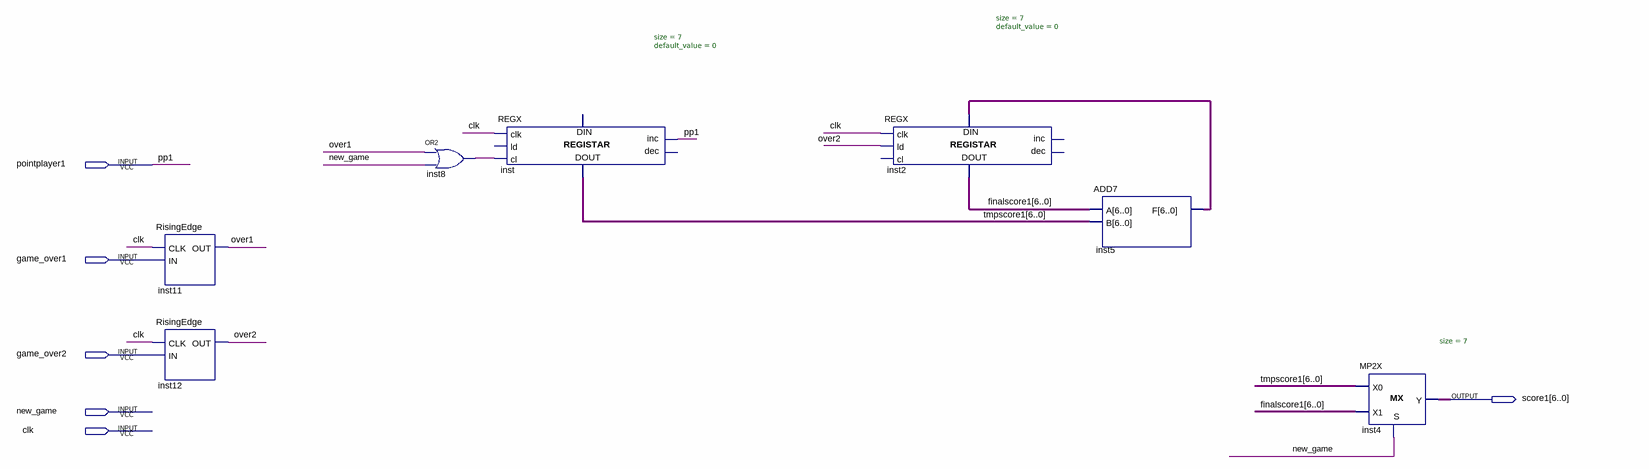
[diagram p0: schematic sheet]
// Quartus schematic score_count.bdf as structural Verilog: 7 symbols, 6 pins
module score_count (
  input  pointplayer1,
  input  game_over1,
  input  game_over2,
  input  new_game,
  input  clk,
  output [6:0] score1
);

  wire inst8_out, over1, over2;
  wire [6:0] finalscore1, inst5_f, tmpscore1;

  RisingEdge inst11 (.CLK(clk), .IN(game_over1), .OUT(over1));
  RisingEdge inst12 (.CLK(clk), .IN(game_over2), .OUT(over2));
  or inst8 (inst8_out, over1, new_game);
  REGX #(.size(7), .default_value(0)) inst (
    .clk(clk), .cl(inst8_out), .inc(pointplayer1), .data_out(tmpscore1));  // open: ld, dec, data_in
  REGX #(.size(7), .default_value(0)) inst2 (
    .clk(clk), .ld(over2), .data_in(inst5_f), .data_out(finalscore1));  // open: cl, inc, dec
  ADD7 inst5 (.A(finalscore1), .B(tmpscore1), .F(inst5_f));
  MP2X #(.size(7)) inst4 (.S(new_game), .X0(tmpscore1), .X1(finalscore1), .Y(score1));

  // Other names for the same wires on the sheet: pp1 = pointplayer1
endmodule
